# Altium project PCB2_Lab2.PrjPcb
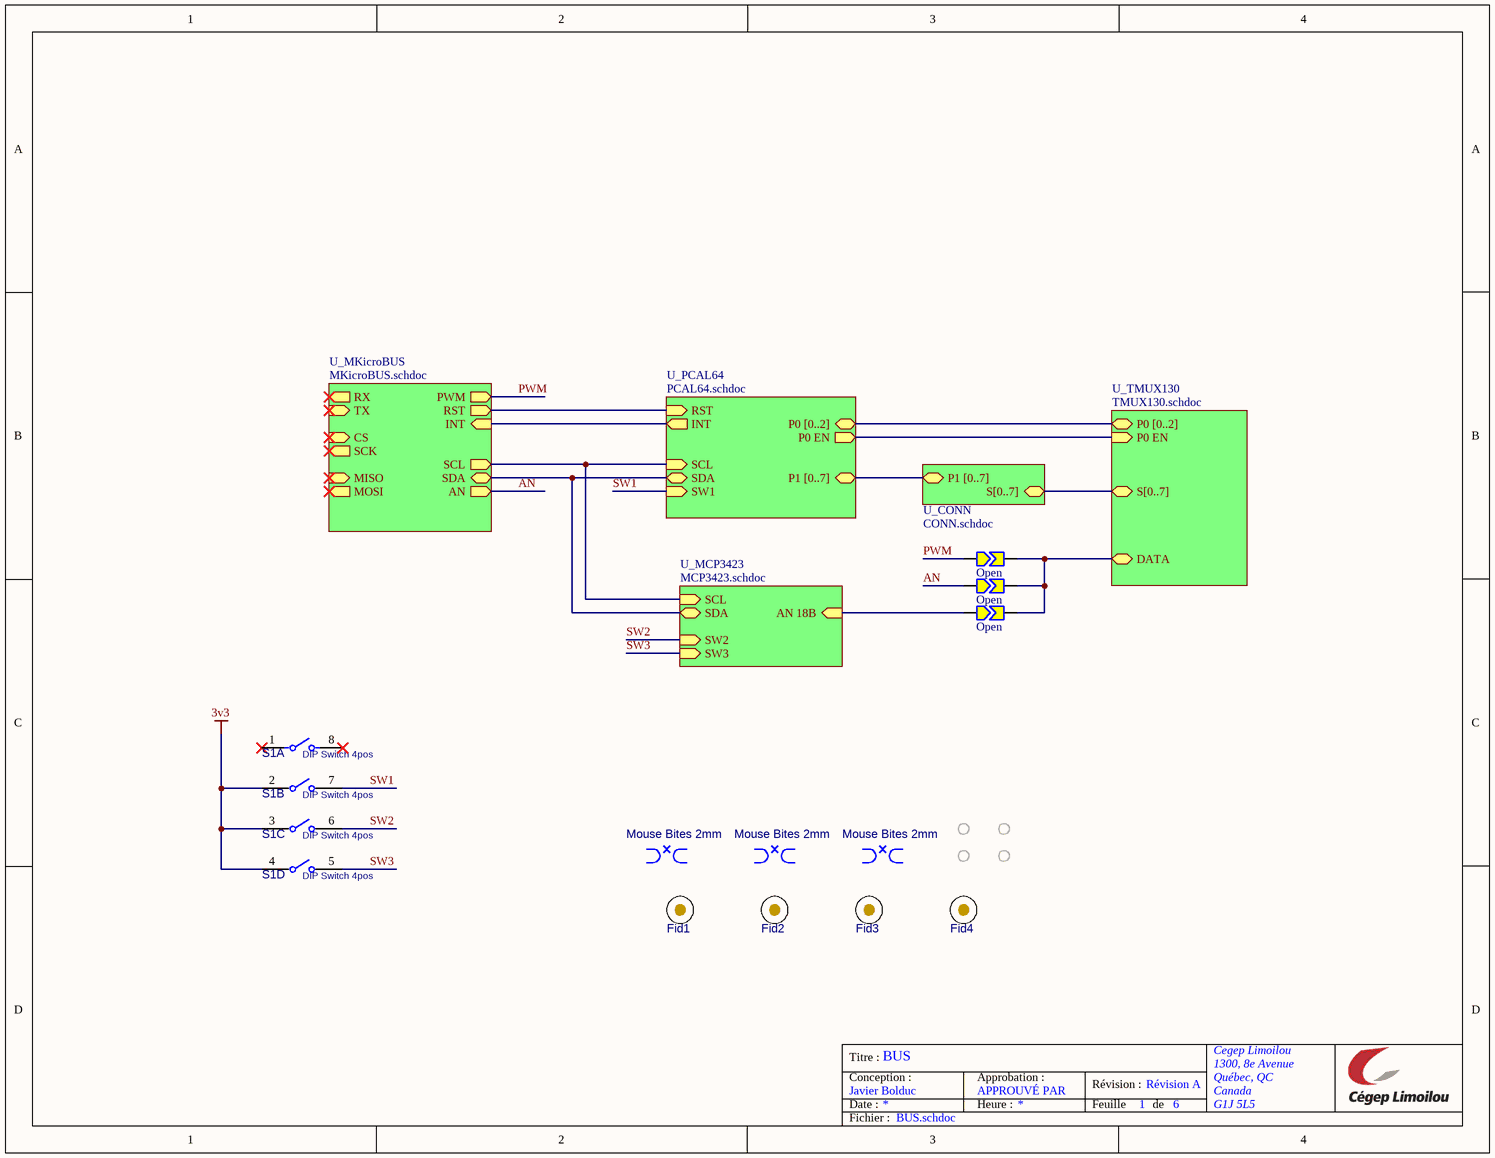
[diagram p0: BUS.schdoc]
6 sheets, 53 parts. Net scope: hierarchical (ports join the sheet entries above them; power ports are global).
Board file: PCB1.PcbDoc
Sheets:
  BUS.schdoc
    U_CONN = CONN.schdoc
    U_MKicroBUS = MKicroBUS.schdoc
    U_PCAL64 = PCAL64.schdoc
    U_TMUX130 = TMUX130.schdoc
    U_MCP3423 = MCP3423.schdoc

## Sheet BUS.schdoc: TITRE
size Letter; ApprovedBy: APPROUVÉ PAR; Organization: Cegep Limoilou; Address1: 1300, 8e Avenue; Address2: Québec, QC; Address3: Canada; Address4: G1J 5L5; SheetNumber: 1; SheetTotal: 6

### Parts
BRK1  value Mouse Bites 2mm  [BK_CRACK1B_M]  (hidden comment: DNP)  (no BOM)
BRK3  value Mouse Bites 2mm  [BK_CRACK1B_M]  (hidden comment: DNP)  (no BOM)
BRK4  value Mouse Bites 2mm  [BK_CRACK1B_M]  (hidden comment: DNP)  (no BOM)
Fid1  DNP  [FD_Fiducial]  (value not drawn)  (no BOM)
Fid2  DNP  [FD_Fiducial]  (value not drawn)  (no BOM)
Fid3  DNP  [FD_Fiducial]  (value not drawn)  (no BOM)
Fid4  DNP  [FD_Fiducial]  (value not drawn)  (no BOM)
MH1  DNP  [MP_M-Hole_M2-NonPlated]  (value not drawn)  (no BOM)
MH2  DNP  [MP_M-Hole_M2-NonPlated]  (value not drawn)  (no BOM)
MH3  DNP  [MP_M-Hole_M2-NonPlated]  (value not drawn)  (no BOM)
MH4  DNP  [MP_M-Hole_M2-NonPlated]  (value not drawn)  (no BOM)
S1  value DIP Switch 4pos  [S_DIP_SWITCH_50MIL_4POS]  (hidden comment: DSHP04TSGER)  (parts A,B,C,D of 4)
SB1  Open  [SB-TINY-OPEN]  (no BOM)
SB2  Open  [SB-TINY-OPEN]  (no BOM)
SB3  Open  [SB-TINY-OPEN]  (no BOM)

### Sub-sheets
U_CONN = CONN.schdoc: S[0..7] (bidir), P1 [0..7] (bidir)
U_MCP3423 = MCP3423.schdoc: AN 18B (in), SDA (bidir), SCL (in), SW2 (in), SW3 (in)
U_MKicroBUS = MKicroBUS.schdoc: AN (out), INT (in), RST (out), SDA (bidir), SCL (out), MOSI (out), MISO (in), RX (out), TX (in), CS (in), SCK (out), PWM (out)
U_PCAL64 = PCAL64.schdoc: P1 [0..7] (bidir), RST (in), INT (out), SDA (bidir), P0 [0..2] (bidir), P0 EN (out), SCL (in), SW1 (in)
U_TMUX130 = TMUX130.schdoc: S[0..7] (bidir), P0 [0..2] (bidir), P0 EN (in), DATA (bidir)

### Nets
3v3: S1.2 S1.3 S1.4
AN: SB2.1 ; sheet U_MKicroBUS/AN
PWM: SB1.1 ; sheet U_MKicroBUS/PWM
SW1: S1.7 ; sheet U_PCAL64/SW1
SW2: S1.6 ; sheet U_MCP3423/SW2
SW3: S1.5 ; sheet U_MCP3423/SW3
NetP1_2: sheet U_MKicroBUS/RST, sheet U_PCAL64/RST
NetP2_2: sheet U_MKicroBUS/INT, sheet U_PCAL64/INT
NetP2_5: sheet U_MKicroBUS/SCL, sheet U_PCAL64/SCL, sheet U_MCP3423/SCL
NetP2_6: sheet U_MKicroBUS/SDA, sheet U_PCAL64/SDA, sheet U_MCP3423/SDA
NetR17_1: SB3.1 ; sheet U_MCP3423/AN 18B
NetSB1_2: SB1.2 SB2.2 SB3.2 ; sheet U_TMUX130/DATA
NetU2_7: sheet U_PCAL64/P0 EN, sheet U_TMUX130/P0 EN

Not connected (* = marked no-connect by the designer): BRK1 1 2 3 4 5; BRK3 1 2 3 4 5; BRK4 1 2 3 4 5; Fid1 1 2 3 4 5; Fid2 1 2 3 4 5; Fid3 1 2 3 4 5; Fid4 1 2 3 4 5; S1 1* 8*

### Buses and harness runs
bus sheet U_CONN/P1 [0..7] = sheet U_PCAL64/P1 [0..7]
bus sheet U_CONN/S[0..7] = sheet U_TMUX130/S[0..7]
bus sheet U_PCAL64/P0 [0..2] = sheet U_TMUX130/P0 [0..2]

### Notes on the sheet
- Titre :
- Conception :
- Date :
- Javier Bolduc
- BUS
- Approbation :
- Heure :
- Révision :
- Feuille
- Révision A
- de
- Fichier :

### Library data of the parts
BRK1 BRK3 BRK4 = BK_BREAKOUT_2MM: Mouse Bites; Mounting Technology: N/A
Fid1-Fid4 = Fiducial: Fiducial mark for alignement and Pick&Place; Value: Fiducial mark; Mounting Technology: N/A
MH1-MH4 = MH-2MM_NP: Mounting Hole 2mm non plated; Manufacturer Part Number 1: DNP; Mounting Technology: N/A; Value: Mounting Hole 2mm non plated; Supplier Part Number 1: N/A
S1 = SW_DIP_50MIL_4POS: SWITCH DIP SLIDE SPST 25MA 24V, pitch 1.27mm, height 1.55mm; Manufacturer 1: kangshen; Manufacturer 2: Omron; Manufacturer Part Number 1: DSHP04TSGER; Manufacturer Part Number 2: A6H-4102-PM; Mounting Technology: SMT; Supplier 1: LCSC; Supplier 2: LCSC; Supplier Part Number 1: C3293144; Supplier Part Number 2: C2733274; Supplier 3: Digikey; Supplier Part Number 3: 39-A6H-4102-PMCT-ND
SB1-SB3 = Solder-Jumper-Open: Solder Jumper

## Sheet CONN.schdoc: TITRE
size Letter; ApprovedBy: APPROUVÉ PAR; Organization: Cegep Limoilou; Address1: 1300, 8e Avenue; Address2: Québec, QC; Address3: Canada; Address4: G1J 5L5; SheetNumber: 2; SheetTotal: 6
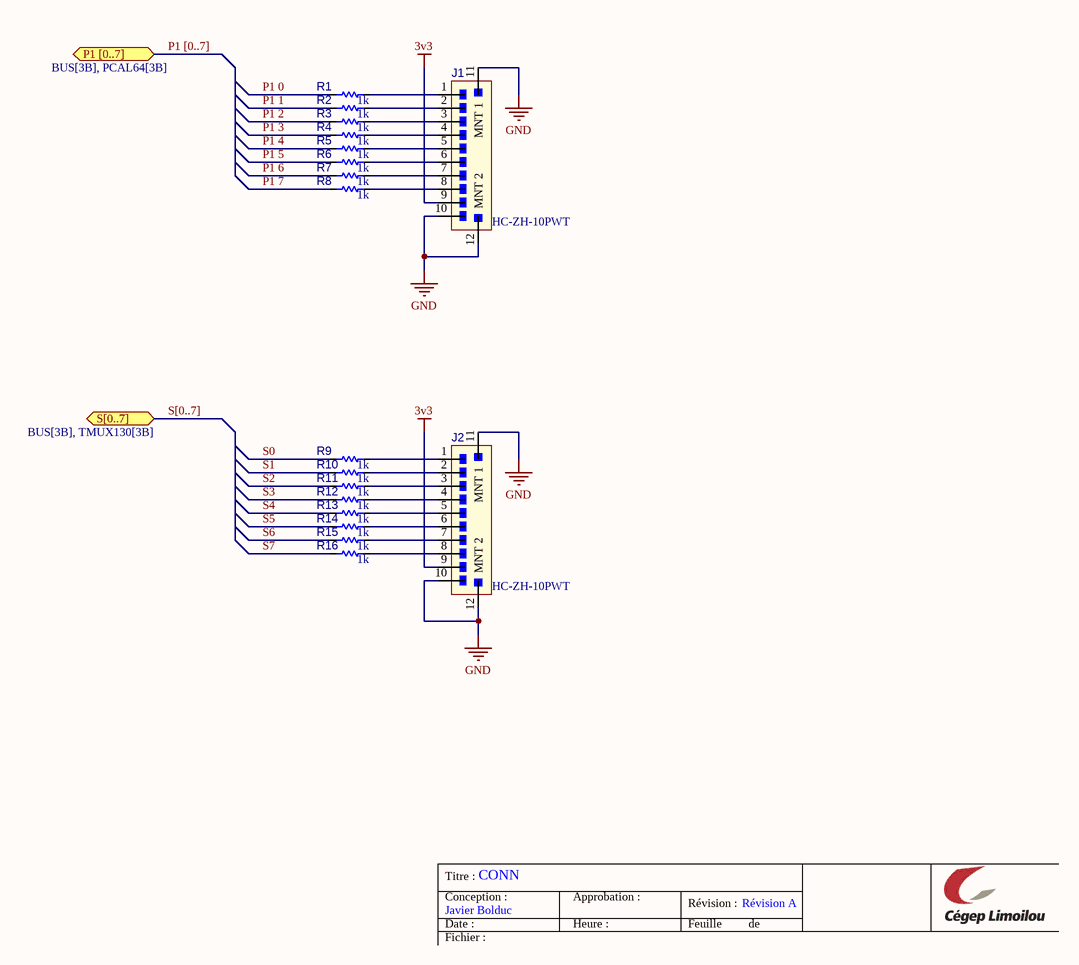
[diagram p1: CONN.schdoc]

### Parts
J1  HC-ZH-10PWT  [J_S10B-ZR-SM4]
J2  HC-ZH-10PWT  [J_S10B-ZR-SM4]
R1  value 1k  [R_1608[0603]]  (hidden comment: Res 1k 1% 0603)
R2  value 1k  [R_1608[0603]]  (hidden comment: Res 1k 1% 0603)
R3  value 1k  [R_1608[0603]]  (hidden comment: Res 1k 1% 0603)
R4  value 1k  [R_1608[0603]]  (hidden comment: Res 1k 1% 0603)
R5  value 1k  [R_1608[0603]]  (hidden comment: Res 1k 1% 0603)
R6  value 1k  [R_1608[0603]]  (hidden comment: Res 1k 1% 0603)
R7  value 1k  [R_1608[0603]]  (hidden comment: Res 1k 1% 0603)
R8  value 1k  [R_1608[0603]]  (hidden comment: Res 1k 1% 0603)
R9  value 1k  [R_1608[0603]]  (hidden comment: Res 1k 1% 0603)
R10  value 1k  [R_1608[0603]]  (hidden comment: Res 1k 1% 0603)
R11  value 1k  [R_1608[0603]]  (hidden comment: Res 1k 1% 0603)
R12  value 1k  [R_1608[0603]]  (hidden comment: Res 1k 1% 0603)
R13  value 1k  [R_1608[0603]]  (hidden comment: Res 1k 1% 0603)
R14  value 1k  [R_1608[0603]]  (hidden comment: Res 1k 1% 0603)
R15  value 1k  [R_1608[0603]]  (hidden comment: Res 1k 1% 0603)
R16  value 1k  [R_1608[0603]]  (hidden comment: Res 1k 1% 0603)

### Ports
P1 [0..7] (bidir, see BUS[3B], PCAL64[3B]), S[0..7] (bidir, see BUS[3B], TMUX130[3B])

### Nets
3v3: J1.9 J2.9
GND: J1.10 J1.11(MNT_1) J1.12(MNT_2) J2.10 J2.11(MNT_1) J2.12(MNT_2)
P1 0: R1.2
P1 1: R2.2
P1 2: R3.2
P1 3: R4.2
P1 4: R5.2
P1 5: R6.2
P1 6: R7.2
P1 7: R8.2
S0: R9.2
S1: R10.2
S2: R11.2
S3: R12.2
S4: R13.2
S5: R14.2
S6: R15.2
S7: R16.2
NetJ1_1: J1.1 R1.1
NetJ1_2: J1.2 R2.1
NetJ1_3: J1.3 R3.1
NetJ1_4: J1.4 R4.1
NetJ1_5: J1.5 R5.1
NetJ1_6: J1.6 R6.1
NetJ1_7: J1.7 R7.1
NetJ1_8: J1.8 R8.1
NetJ2_1: J2.1 R9.1
NetJ2_2: J2.2 R10.1
NetJ2_3: J2.3 R11.1
NetJ2_4: J2.4 R12.1
NetJ2_5: J2.5 R13.1
NetJ2_6: J2.6 R14.1
NetJ2_7: J2.7 R15.1
NetJ2_8: J2.8 R16.1

### Buses and harness runs
bus P1 [0..7] = port P1 [0..7]
bus S[0..7] = port S[0..7]

### Notes on the sheet
- Titre :
- Conception :
- Date :
- Javier Bolduc
- CONN
- Approbation :
- Heure :
- Révision :
- Feuille
- Révision A
- de
- Fichier :

### Library data of the parts
J1 J2 = CONN-1MM5-01X10-S10B-H-SMT: CONN wire to board SMT R/A 10POS 1.5mm; Manufacturer 1: HCTL; Manufacturer Part Number 1: HC-ZH-10PWT; Manufacturer 2: JST; Manufacturer Part Number 2: S10B-ZR-SM4A-TF(LF)(SN); Mounting Technology: SMT; Supplier 1: LCSC; Supplier 2: LCSC; Supplier Part Number 1: C2845432; Supplier Part Number 2: C5149249; Supplier 3: Digikey; Supplier Part Number 3: 455-1700-1-ND
R1-R16 = RES015: Resistor type 1; Manufacturer 1: Yageo; Manufacturer Part Number 1: RC0603FR-071KL; LibRef: RES015; Puissance: 1/10W; Max Working Voltage: 75V; Tolerance: 1%; Mounting Technology: SMT; Supplier 1: LCSC; Supplier Part Number 1: C22548

## Sheet MKicroBUS.schdoc: TITRE
size Letter; ApprovedBy: APPROUVÉ PAR; Organization: Cegep Limoilou; Address1: 1300, 8e Avenue; Address2: Québec, QC; Address3: Canada; Address4: G1J 5L5; SheetNumber: 6; SheetTotal: 6
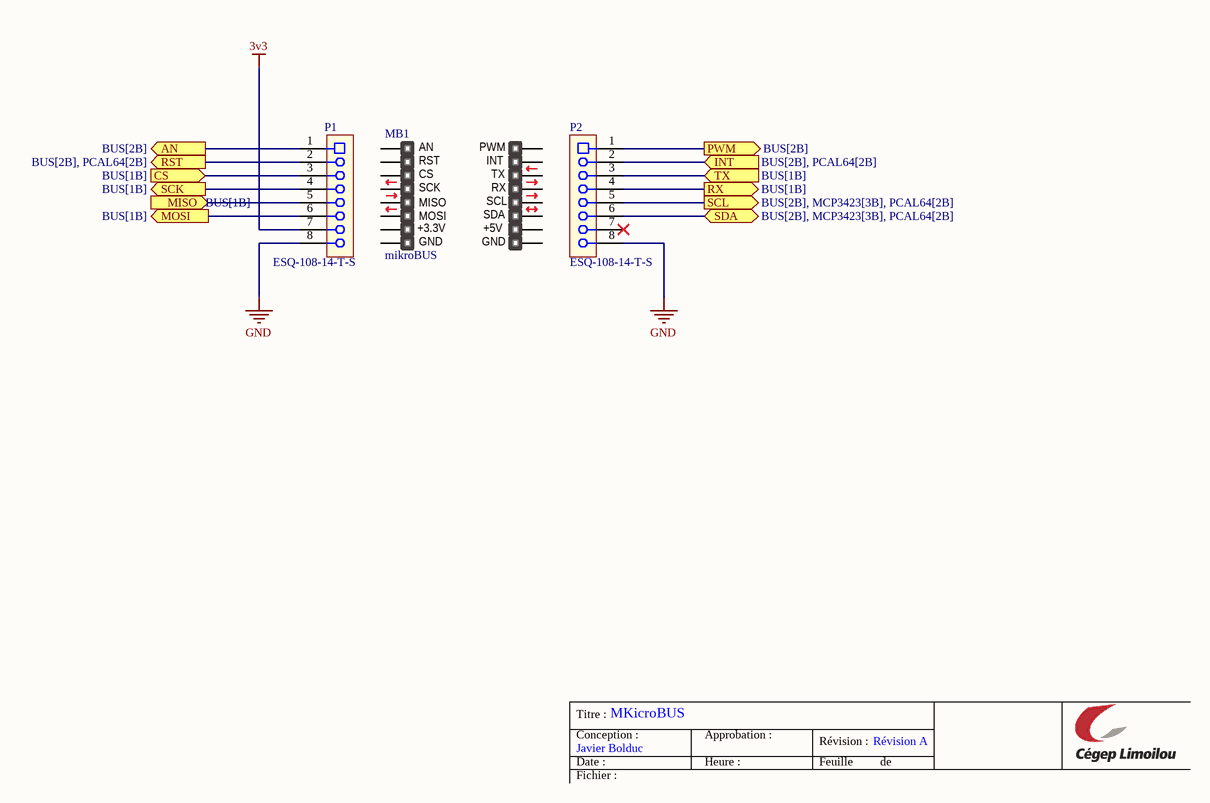
[diagram p2: MKicroBUS.schdoc]

### Parts
MB1  mikroBUS  [mikroBUS-Midi-No-Connector]  (no BOM)
P1  ESQ-108-14-T-S  [CONN_SKT_01X08_100MIL-ELEVATED-LONGPIN]
P2  ESQ-108-14-T-S  [CONN_SKT_01X08_100MIL-ELEVATED-LONGPIN]

### Ports
AN (out, see BUS[2B]), CS (in, see BUS[1B]), INT (in, see BUS[2B], PCAL64[2B]), MISO (in, see BUS[1B]), MOSI (out, see BUS[1B]), PWM (out, see BUS[2B]), RST (out, see BUS[2B], PCAL64[2B]), RX (out, see BUS[1B]), SCK (out, see BUS[1B]), SCL (out, see BUS[2B], MCP3423[3B], PCAL64[2B]), SDA (bidir, see BUS[2B], MCP3423[3B], PCAL64[2B]), TX (in, see BUS[1B])

### Nets
3v3: P1.7
GND: P1.8 P2.8
AN: P1.1 ; port AN
PWM: P2.1 ; port PWM
NetP1_2: P1.2 ; port RST
NetP1_3: P1.3 ; port CS
NetP1_4: P1.4 ; port SCK
NetP1_5: P1.5 ; port MISO
NetP1_6: P1.6 ; port MOSI
NetP2_2: P2.2 ; port INT
NetP2_3: P2.3 ; port TX
NetP2_4: P2.4 ; port RX
NetP2_5: P2.5 ; port SCL
NetP2_6: P2.6 ; port SDA

Not connected (* = marked no-connect by the designer): MB1 1(AN) 2(RST) 3(CS) 4(SCK) 5(MISO) 6(MOSI) 7(3.3V) 8(GND) 9(GND) 10(5V) 11(SDA) 12(SCL) 13(TX) 14(RX) 15(INT) 16(PWM); P2 7*

### Notes on the sheet
- Titre :
- Conception :
- Date :
- Javier Bolduc
- MKicroBUS
- Approbation :
- Heure :
- Révision :
- Feuille
- Révision A
- de
- Fichier :
- (in symbol mikroBUS compatible add-on board) +3.3V; +5V

### Library data of the parts
MB1 = mikroBUS compatible add-on board
P1 P2 = CONN-100MIL-SKT-01X08_ELEVATED_LONGPIN: CONN SOCKET 8pos 100mils Elevated; Manufacturer 1: Samtec; Mounting Technology: TH; Manufacturer Part Number 1: ESQ-108-14-T-S; Supplier 1: Digikey; Supplier Part Number 1: SAM9303-ND

## Sheet PCAL64.schdoc: TITRE
size Letter; ApprovedBy: APPROUVÉ PAR; Organization: Cegep Limoilou; Address1: 1300, 8e Avenue; Address2: Québec, QC; Address3: Canada; Address4: G1J 5L5; SheetNumber: 4; SheetTotal: 6
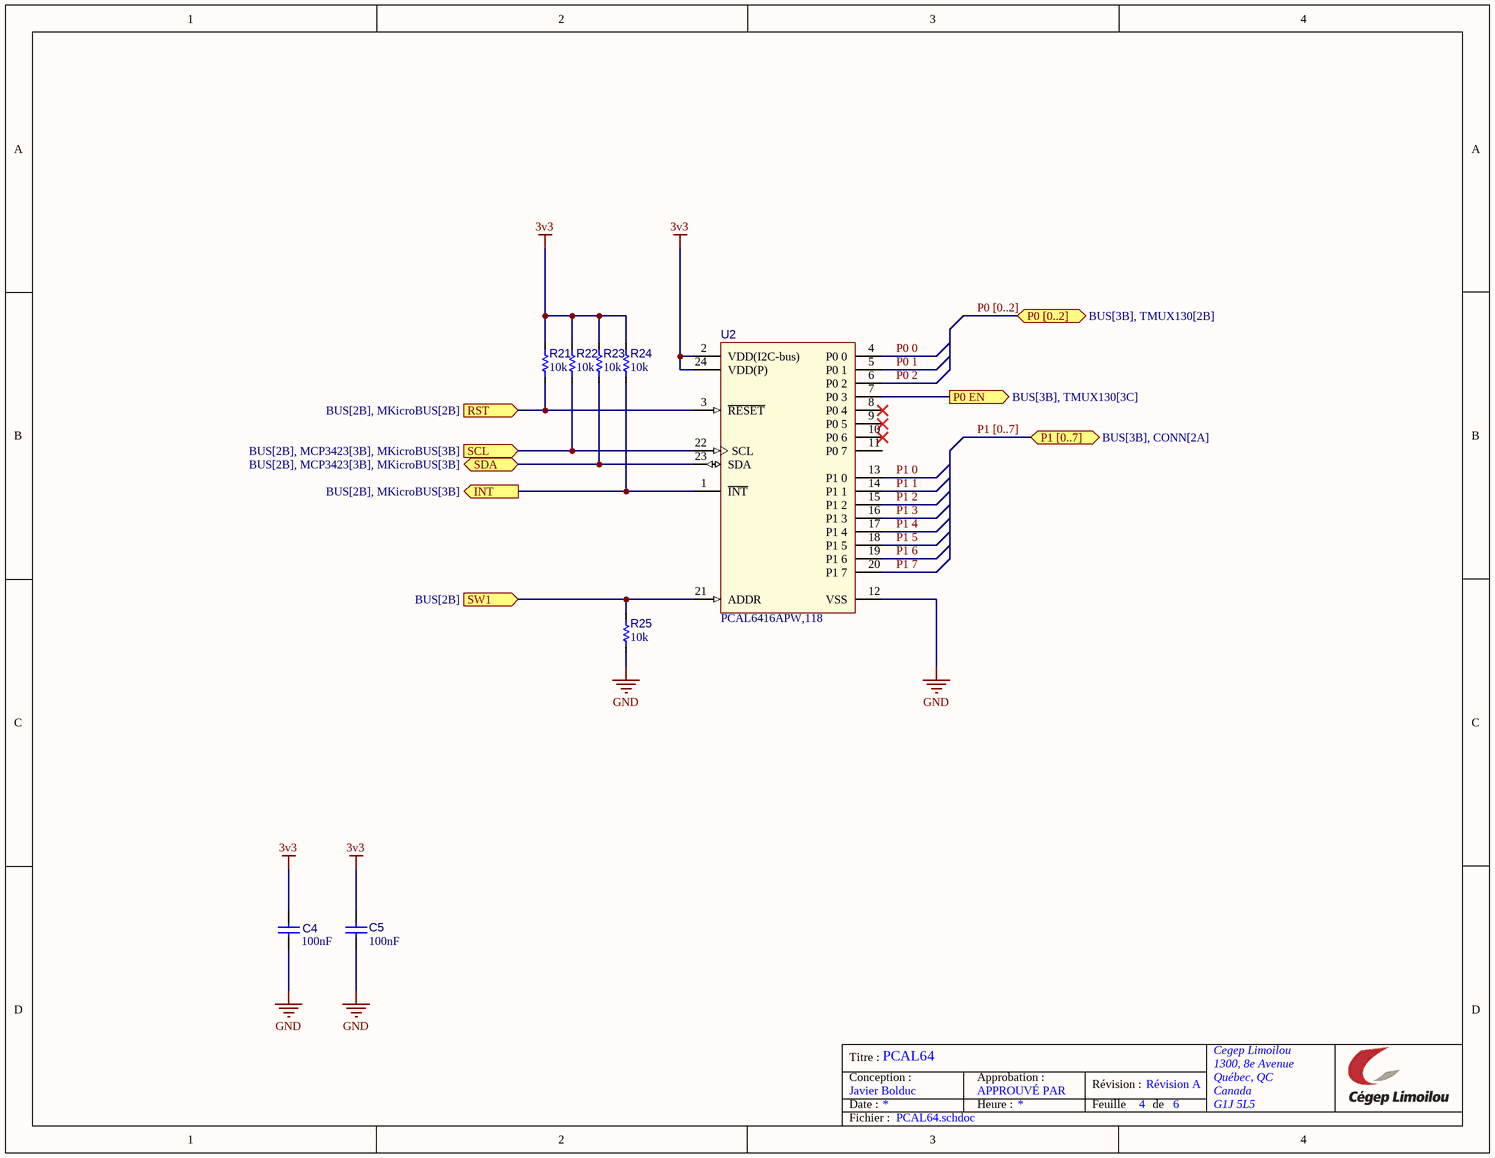
[diagram p3: PCAL64.schdoc]

### Parts
C4  value 100nF  [C_1608[0603]]  (hidden comment: CAP CER 100nF 50V 0603)
C5  value 100nF  [C_1608[0603]]  (hidden comment: CAP CER 100nF 50V 0603)
R21  value 10k  [R_1608[0603]]  (hidden comment: Res 10k 1% 0603)
R22  value 10k  [R_1608[0603]]  (hidden comment: Res 10k 1% 0603)
R23  value 10k  [R_1608[0603]]  (hidden comment: Res 10k 1% 0603)
R24  value 10k  [R_1608[0603]]  (hidden comment: Res 10k 1% 0603)
R25  value 10k  [R_1608[0603]]  (hidden comment: Res 10k 1% 0603)
U2  PCAL6416APW,118  [U_TSSOP24_SOT355-1-IPC_B]

### Ports
INT (out, see BUS[2B], MKicroBUS[3B]), P0 [0..2] (bidir, see BUS[3B], TMUX130[2B]), P0 EN (out, see BUS[3B], TMUX130[3C]), P1 [0..7] (bidir, see BUS[3B], CONN[2A]), RST (in, see BUS[2B], MKicroBUS[2B]), SCL (in, see BUS[2B], MCP3423[3B], MKicroBUS[3B]), SDA (bidir, see BUS[2B], MCP3423[3B], MKicroBUS[3B]), SW1 (in, see BUS[2B])

### Nets
3v3: C4.2 C5.2 R21.1 R22.1 R23.1 R24.1 U2.2(VDD(I2C-bus)) U2.24(VDD(P))
GND: C4.1 C5.1 R25.2 U2.12(VSS)
P0 0: U2.4(P0_0)
P0 1: U2.5(P0_1)
P0 2: U2.6(P0_2)
P1 0: U2.13(P1_0)
P1 1: U2.14(P1_1)
P1 2: U2.15(P1_2)
P1 3: U2.16(P1_3)
P1 4: U2.17(P1_4)
P1 5: U2.18(P1_5)
P1 6: U2.19(P1_6)
P1 7: U2.20(P1_7)
SW1: R25.1 U2.21(ADDR) ; port SW1
NetP1_2: R21.2 U2.3(~{RESET}) ; port RST
NetP2_2: R24.2 U2.1(~{INT}) ; port INT
NetP2_5: R22.2 U2.22(SCL) ; port SCL
NetP2_6: R23.2 U2.23(SDA) ; port SDA
NetU2_7: U2.7(P0_3) ; port P0 EN

Not connected (* = marked no-connect by the designer): U2 8(P0_4)* 9(P0_5)* 10(P0_6)* 11(P0_7)

### Buses and harness runs
bus P0 [0..2] = port P0 [0..2]
bus P1 [0..7] = port P1 [0..7]

### Notes on the sheet
- Titre :
- Conception :
- Date :
- Javier Bolduc
- PCAL64
- Approbation :
- Heure :
- Révision :
- Feuille
- Révision A
- de
- Fichier :

### Library data of the parts
C4 C5 = CAP002: Capacitor type 1; Manufacturer 1: Yageo; Manufacturer Part Number 1: CC0603KRX7R9BB104; LibRef: CAP002; Code CEGEP: COND0143SM; Tolerance: 10%; Dielectric: X7R; Rated Voltage: 50V; Mounting Technology: SMT; Supplier 1: LCSC; Supplier Part Number 1: C14663
R21-R25 = RES001: Resistor type 1; Manufacturer 1: Yageo; Manufacturer Part Number 1: RC0603FR-0710KL; LibRef: RES001; Puissance: 1/10W; Max Working Voltage: 75V; Code CEGEP: RESI0238-0603; Tolerance: 1%; Mounting Technology: SMT; Supplier 1: LCSC; Supplier Part Number 1: C98220
U2 = U_PCAL6416APW: IC I/O EXPANDER 16BIT 24TSSOP; Manufacturer Part Number 1: TCA6416APWR; Manufacturer 1: Texas Instruments; Manufacturer 2: NXP Semiconductors; Manufacturer Part Number 2: PCAL6416APW,118; Mounting Technology: SMT; Supplier 1: LCSC; Supplier 2: LCSC; Supplier 3: Digikey; Supplier Part Number 1: C130203; Supplier Part Number 2: C2652299; Supplier Part Number 3: 568-9922-1-ND

## Sheet TMUX130.schdoc: TITRE
size Letter; ApprovedBy: APPROUVÉ PAR; Organization: Cegep Limoilou; Address1: 1300, 8e Avenue; Address2: Québec, QC; Address3: Canada; Address4: G1J 5L5; SheetNumber: 5; SheetTotal: 6
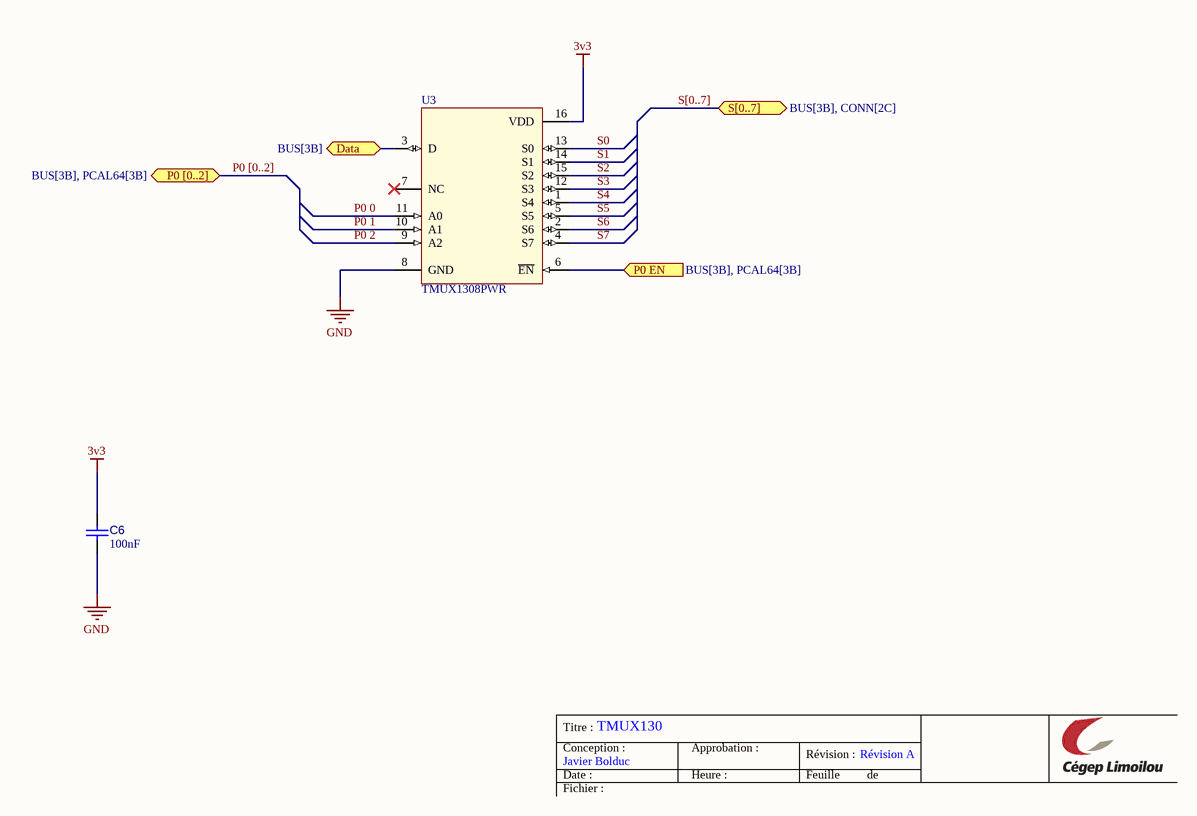
[diagram p4: TMUX130.schdoc]

### Parts
C6  value 100nF  [C_1608[0603]]  (hidden comment: CAP CER 100nF 50V 0603)
U3  TMUX1308PWR  [U_TSSOP65P500X450-16]

### Ports
Data (bidir, see BUS[3B]), P0 [0..2] (bidir, see BUS[3B], PCAL64[3B]), P0 EN (in, see BUS[3B], PCAL64[3B]), S[0..7] (bidir, see BUS[3B], CONN[2C])

### Nets
3v3: C6.2 U3.16(VDD)
GND: C6.1 U3.8(GND)
P0 0: U3.11(A0)
P0 1: U3.10(A1)
P0 2: U3.9(A2)
S0: U3.13(S0)
S1: U3.14(S1)
S2: U3.15(S2)
S3: U3.12(S3)
S4: U3.1(S4)
S5: U3.5(S5)
S6: U3.2(S6)
S7: U3.4(S7)
NetSB1_2: U3.3(D) ; port Data
NetU2_7: U3.6(~{EN}) ; port P0 EN

Not connected (* = marked no-connect by the designer): U3 7(NC)*

### Buses and harness runs
bus P0 [0..2] = port P0 [0..2]
bus S[0..7] = port S[0..7]

### Notes on the sheet
- Titre :
- Conception :
- Date :
- Javier Bolduc
- TMUX130
- Approbation :
- Heure :
- Révision :
- Feuille
- Révision A
- de
- Fichier :

### Library data of the parts
C6 = CAP002: as C4 on sheet PCAL64; Rated Voltage: 50V; Mounting Technology: SMT; Supplier 1: LCSC; Supplier Part Number 1: C14663
U3 = U_TMUX1308PWR: IC MUX 8:1 195OHM 16TSSOP; Manufacturer 1: TI; Manufacturer Part Number 1: TMUX1308PWR; Mounting Technology: SMT; Supplier 1: LCSC; Supplier 2: Digikey; Supplier Part Number 1: C970231; Supplier Part Number 2: 296-TMUX1308PWRCT-ND

## Sheet MCP3423.schdoc: TITRE
size Letter; ApprovedBy: APPROUVÉ PAR; Organization: Cegep Limoilou; Address1: 1300, 8e Avenue; Address2: Québec, QC; Address3: Canada; Address4: G1J 5L5; SheetNumber: 3; SheetTotal: 6
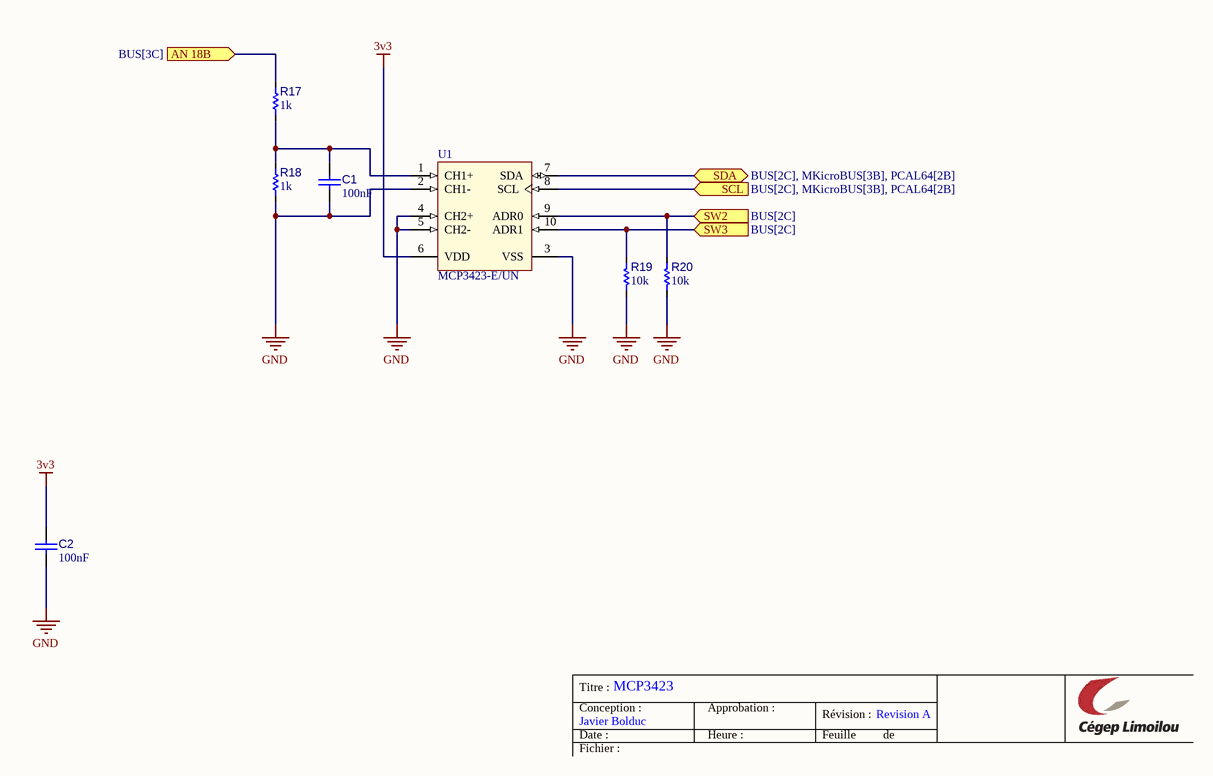
[diagram p5: MCP3423.schdoc]

### Parts
C1  value 100nF  [C_1608[0603]]  (hidden comment: CAP CER 100nF 50V 0603)
C2  value 100nF  [C_1608[0603]]  (hidden comment: CAP CER 100nF 50V 0603)
R17  value 1k  [R_1608[0603]]  (hidden comment: Res 1k 1% 0603)
R18  value 1k  [R_1608[0603]]  (hidden comment: Res 1k 1% 0603)
R19  value 10k  [R_1608[0603]]  (hidden comment: Res 10k 1% 0603)
R20  value 10k  [R_1608[0603]]  (hidden comment: Res 10k 1% 0603)
U1  MCP3423-E/UN  [U_MSOP50P300X500-10(RM-10)_WO-TP]

### Ports
AN 18B (in, see BUS[3C]), SCL (in, see BUS[2C], MKicroBUS[3B], PCAL64[2B]), SDA (bidir, see BUS[2C], MKicroBUS[3B], PCAL64[2B]), SW2 (in, see BUS[2C]), SW3 (in, see BUS[2C])

### Nets
3v3: C2.2 U1.6(VDD)
GND: C1.2 C2.1 R18.2 R19.2 R20.2 U1.2(CH1-) U1.3(VSS) U1.4(CH2+) U1.5(CH2-)
SW2: R20.1 U1.9(ADR0) ; port SW2
SW3: R19.1 U1.10(ADR1) ; port SW3
NetC1_1: C1.1 R17.2 R18.1 U1.1(CH1+)
NetP2_5: U1.8(SCL) ; port SCL
NetP2_6: U1.7(SDA) ; port SDA
NetR17_1: R17.1 ; port AN 18B

### Notes on the sheet
- Titre :
- Conception :
- Date :
- Javier Bolduc
- MCP3423
- Approbation :
- Heure :
- Révision :
- Feuille
- Revision A
- de
- Fichier :

### Library data of the parts
C1 C2 = CAP002: as C4 on sheet PCAL64; Rated Voltage: 50V; Mounting Technology: SMT; Supplier 1: LCSC; Supplier Part Number 1: C14663
R17 R18 = RES015: as R1 on sheet CONN; Tolerance: 1%; Mounting Technology: SMT; Supplier 1: LCSC; Supplier Part Number 1: C22548
R19 R20 = RES001: as R21 on sheet PCAL64; Tolerance: 1%; Mounting Technology: SMT; Supplier 1: LCSC; Supplier Part Number 1: C98220
U1 = U_MCP3423-E/UN: CAN Controller Stand-Alone With SPI, 18-Pin PDIP; Manufacturer 1: Microchip; Manufacturer Part Number 1: MCP3423-E/UN; Supplier 1: LCSC; Supplier Part Number 1: C220864; Mounting Technology: SMT; Supplier 2: Digikey; Supplier Part Number 2: MCP3423-E/UN-ND

## Nets that join several sheets
3v3: BUS (S1.2 S1.3 S1.4), CONN (J1.9 J2.9), MKicroBUS (P1.7), PCAL64 (8 pins), TMUX130 (C6.2 U3.16), MCP3423 (C2.2 U1.6)
GND: CONN (6 pins), MKicroBUS (P1.8 P2.8), PCAL64 (C4.1 C5.1 R25.2 U2.12), TMUX130 (C6.1 U3.8), MCP3423 (9 pins)
AN: BUS (SB2.1), MKicroBUS (P1.1)
NetP1_2: MKicroBUS (P1.2), PCAL64 (R21.2 U2.3)
NetP2_2: MKicroBUS (P2.2), PCAL64 (R24.2 U2.1)
NetP2_5: MKicroBUS (P2.5), PCAL64 (R22.2 U2.22), MCP3423 (U1.8)
NetP2_6: MKicroBUS (P2.6), PCAL64 (R23.2 U2.23), MCP3423 (U1.7)
NetR17_1: BUS (SB3.1), MCP3423 (R17.1)
NetSB1_2: BUS (SB1.2 SB2.2 SB3.2), TMUX130 (U3.3)
NetU2_7: PCAL64 (U2.7), TMUX130 (U3.6)
P0 0: PCAL64 (U2.4), TMUX130 (U3.11)
P0 1: PCAL64 (U2.5), TMUX130 (U3.10)
P0 2: PCAL64 (U2.6), TMUX130 (U3.9)
P1 0: CONN (R1.2), PCAL64 (U2.13)
P1 1: CONN (R2.2), PCAL64 (U2.14)
P1 2: CONN (R3.2), PCAL64 (U2.15)
P1 3: CONN (R4.2), PCAL64 (U2.16)
P1 4: CONN (R5.2), PCAL64 (U2.17)
P1 5: CONN (R6.2), PCAL64 (U2.18)
P1 6: CONN (R7.2), PCAL64 (U2.19)
P1 7: CONN (R8.2), PCAL64 (U2.20)
PWM: BUS (SB1.1), MKicroBUS (P2.1)
S0: CONN (R9.2), TMUX130 (U3.13)
S1: CONN (R10.2), TMUX130 (U3.14)
S2: CONN (R11.2), TMUX130 (U3.15)
S3: CONN (R12.2), TMUX130 (U3.12)
S4: CONN (R13.2), TMUX130 (U3.1)
S5: CONN (R14.2), TMUX130 (U3.5)
S6: CONN (R15.2), TMUX130 (U3.2)
S7: CONN (R16.2), TMUX130 (U3.4)
SW1: BUS (S1.7), PCAL64 (R25.1 U2.21)
SW2: BUS (S1.6), MCP3423 (R20.1 U1.9)
SW3: BUS (S1.5), MCP3423 (R19.1 U1.10)